# EAGLE schematic Caution_Panel_control (EAGLE 7.0.0)
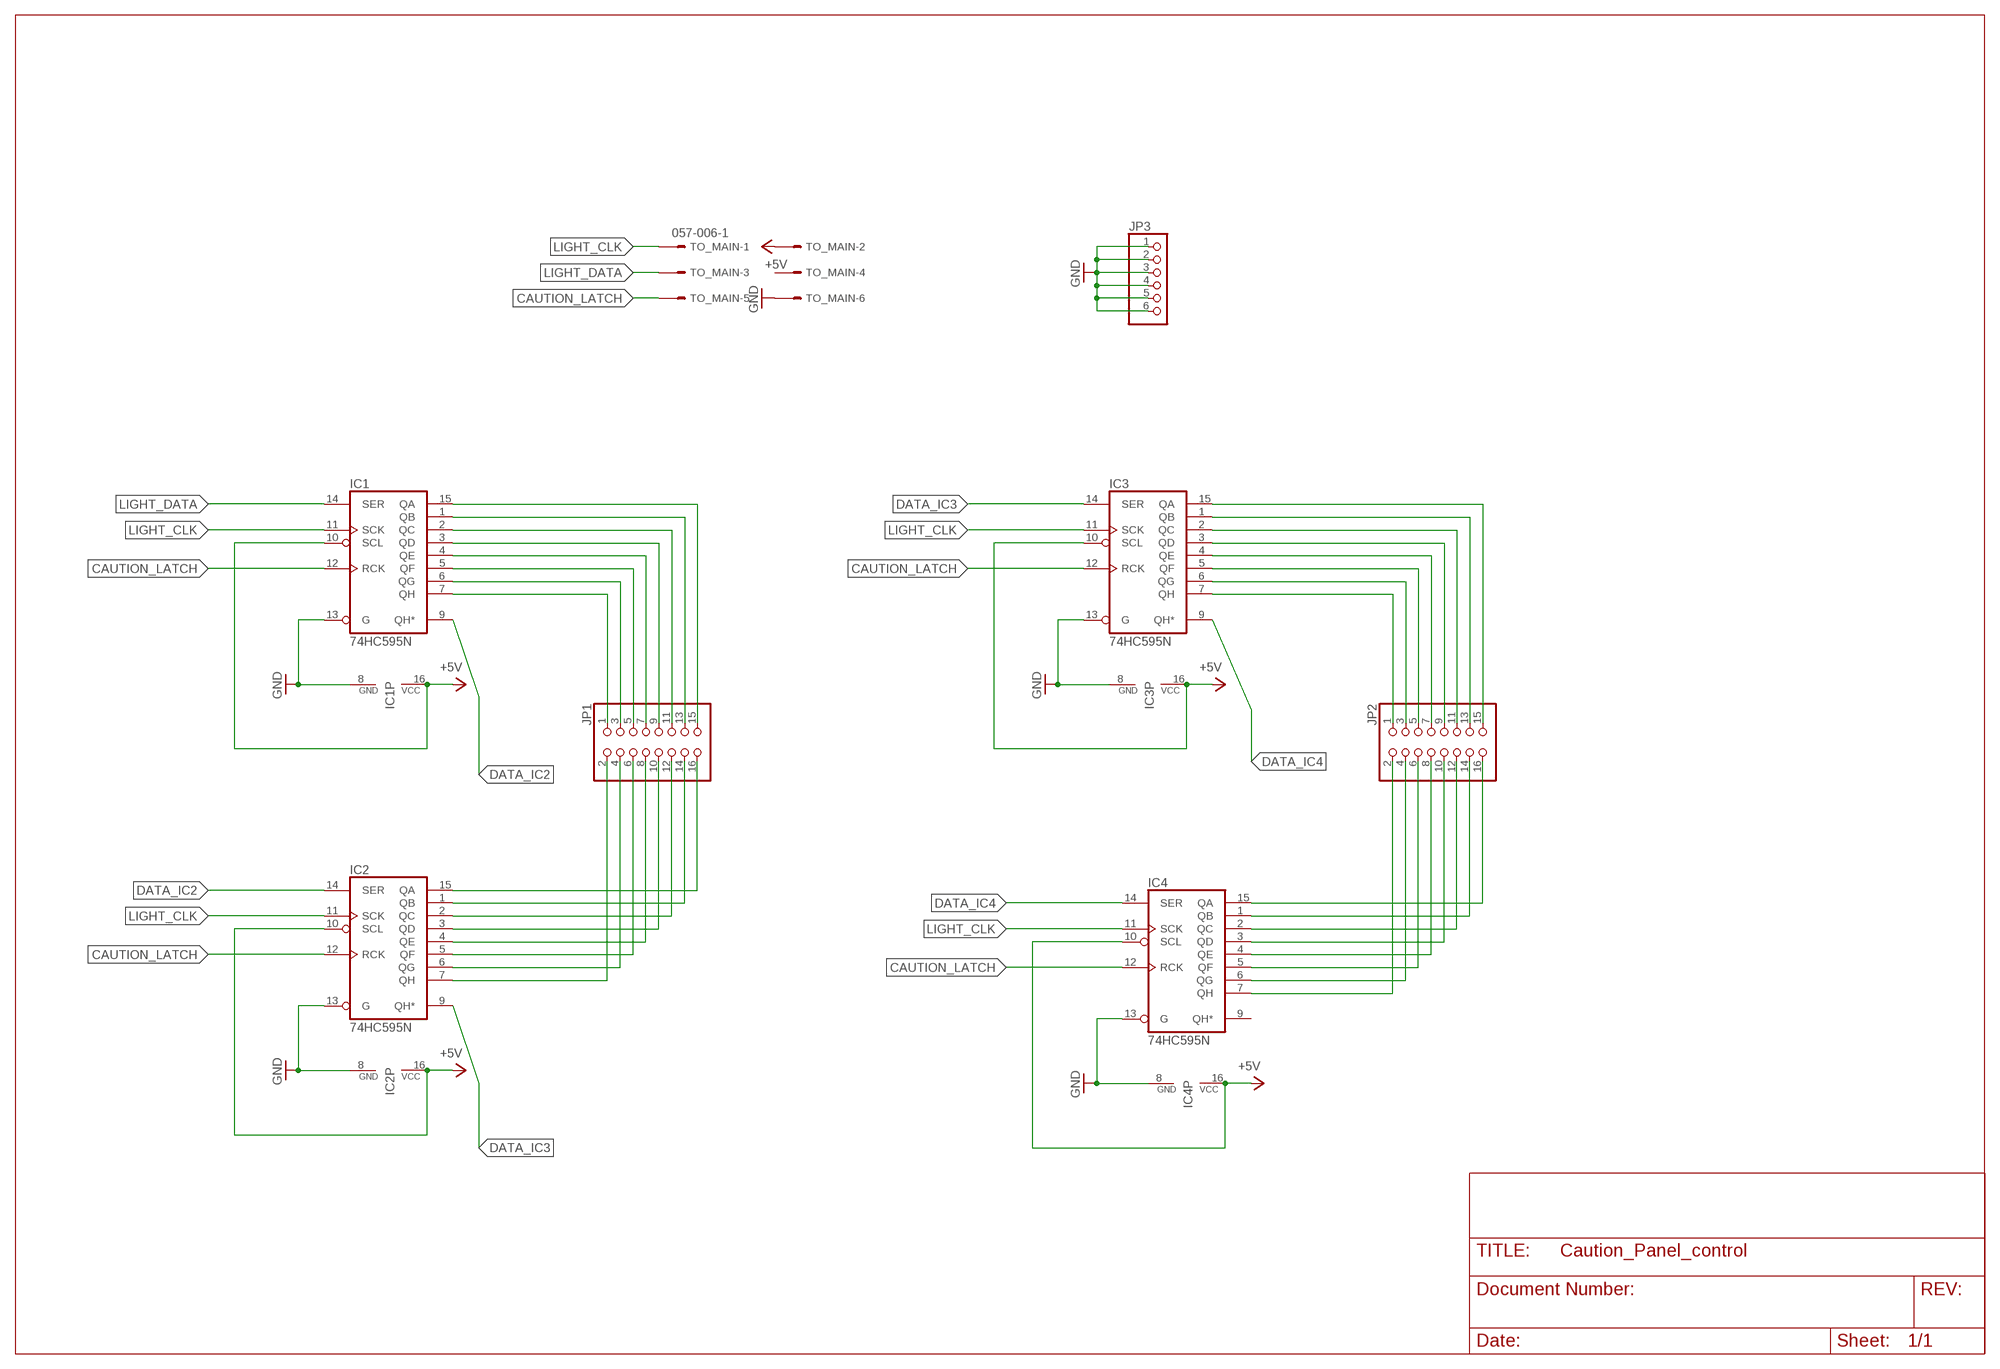
[diagram p0: schematic, sheet 1]

## Parts
IC1  74HC595N  [DIL16]
IC2  74HC595N  [DIL16]
IC3  74HC595N  [DIL16]
IC4  74HC595N  [DIL16]
JP1  PINHD-2X8  [2X08]
JP2  PINHD-2X8  [2X08]
JP3  PINHD-1X6  [1X06]
TO_MAIN  057-006-1  [057-006-1]

## Nets
+5V [Power]: IC1.10(SCL) IC1.16(VCC) IC2.10(SCL) IC2.16(VCC) IC3.10(SCL) IC3.16(VCC) IC4.10(SCL) IC4.16(VCC) TO_MAIN.2
CAUTION_LATCH [Signal]: IC1.12(RCK) IC2.12(RCK) IC3.12(RCK) IC4.12(RCK) TO_MAIN.5
DATA_IC2 [Signal]: IC1.9(QH*) IC2.14(SER)
DATA_IC3 [Signal]: IC2.9(QH*) IC3.14(SER)
DATA_IC4 [Signal]: IC3.9(QH*) IC4.14(SER)
GND [Power]: IC1.8(GND) IC1.13(G) IC2.8(GND) IC2.13(G) IC3.8(GND) IC3.13(G) IC4.8(GND) IC4.13(G) JP3.1 JP3.2 JP3.3 JP3.4 JP3.5 JP3.6 TO_MAIN.6
LIGHT_CLK [Signal]: IC1.11(SCK) IC2.11(SCK) IC3.11(SCK) IC4.11(SCK) TO_MAIN.1
LIGHT_DATA [Signal]: IC1.14(SER) TO_MAIN.3
N$1 [Signal]: IC1.15(QA) JP1.15
N$2 [Signal]: IC1.1(QB) JP1.13
N$3 [Signal]: IC1.2(QC) JP1.11
N$4 [Signal]: IC1.3(QD) JP1.9
N$5 [Signal]: IC1.4(QE) JP1.7
N$6 [Signal]: IC1.5(QF) JP1.5
N$7 [Signal]: IC1.6(QG) JP1.3
N$8 [Signal]: IC1.7(QH) JP1.1
N$9 [Signal]: IC2.15(QA) JP1.16
N$10 [Signal]: IC2.1(QB) JP1.14
N$11 [Signal]: IC2.2(QC) JP1.12
N$12 [Signal]: IC2.3(QD) JP1.10
N$13 [Signal]: IC2.4(QE) JP1.8
N$14 [Signal]: IC2.5(QF) JP1.6
N$15 [Signal]: IC2.6(QG) JP1.4
N$16 [Signal]: IC2.7(QH) JP1.2
N$17 [Signal]: IC4.7(QH) JP2.2
N$18 [Signal]: IC4.6(QG) JP2.4
N$19 [Signal]: IC4.5(QF) JP2.6
N$20 [Signal]: IC4.4(QE) JP2.8
N$21 [Signal]: IC4.3(QD) JP2.10
N$22 [Signal]: IC4.2(QC) JP2.12
N$23 [Signal]: IC4.1(QB) JP2.14
N$24 [Signal]: IC4.15(QA) JP2.16
N$25 [Signal]: IC3.7(QH) JP2.1
N$26 [Signal]: IC3.5(QF) JP2.5
N$27 [Signal]: IC3.6(QG) JP2.3
N$28 [Signal]: IC3.4(QE) JP2.7
N$29 [Signal]: IC3.3(QD) JP2.9
N$30 [Signal]: IC3.2(QC) JP2.11
N$31 [Signal]: IC3.1(QB) JP2.13
N$32 [Signal]: IC3.15(QA) JP2.15
Unconnected: IC4.9(QH*) TO_MAIN.4

## Library data of the parts
IC1-IC4 = 74xx-eu:74*595: 8-bit SHIFT REGISTER, output latch
JP1 JP2 = pinhead:PINHD-2X8: PIN HEADER
JP3 = pinhead:PINHD-1X6: PIN HEADER
TO_MAIN = con-panduit:057-006-: CONNECTOR 6-pin series 057 contact pc board low profile headers; OC_FARNELL: unknown; OC_NEWARK: unknown

## Net classes
0 default: width 0.254 mm, drill 0.254 mm, clearance 0.305 mm
1 Signal: width 0.152 mm, drill 0.152 mm, clearance 0.152 mm
2 Power: width 0.254 mm, drill 0.254 mm, clearance 0.254 mm